# EAGLE design EFS_V2 (EAGLE 9.1.3)
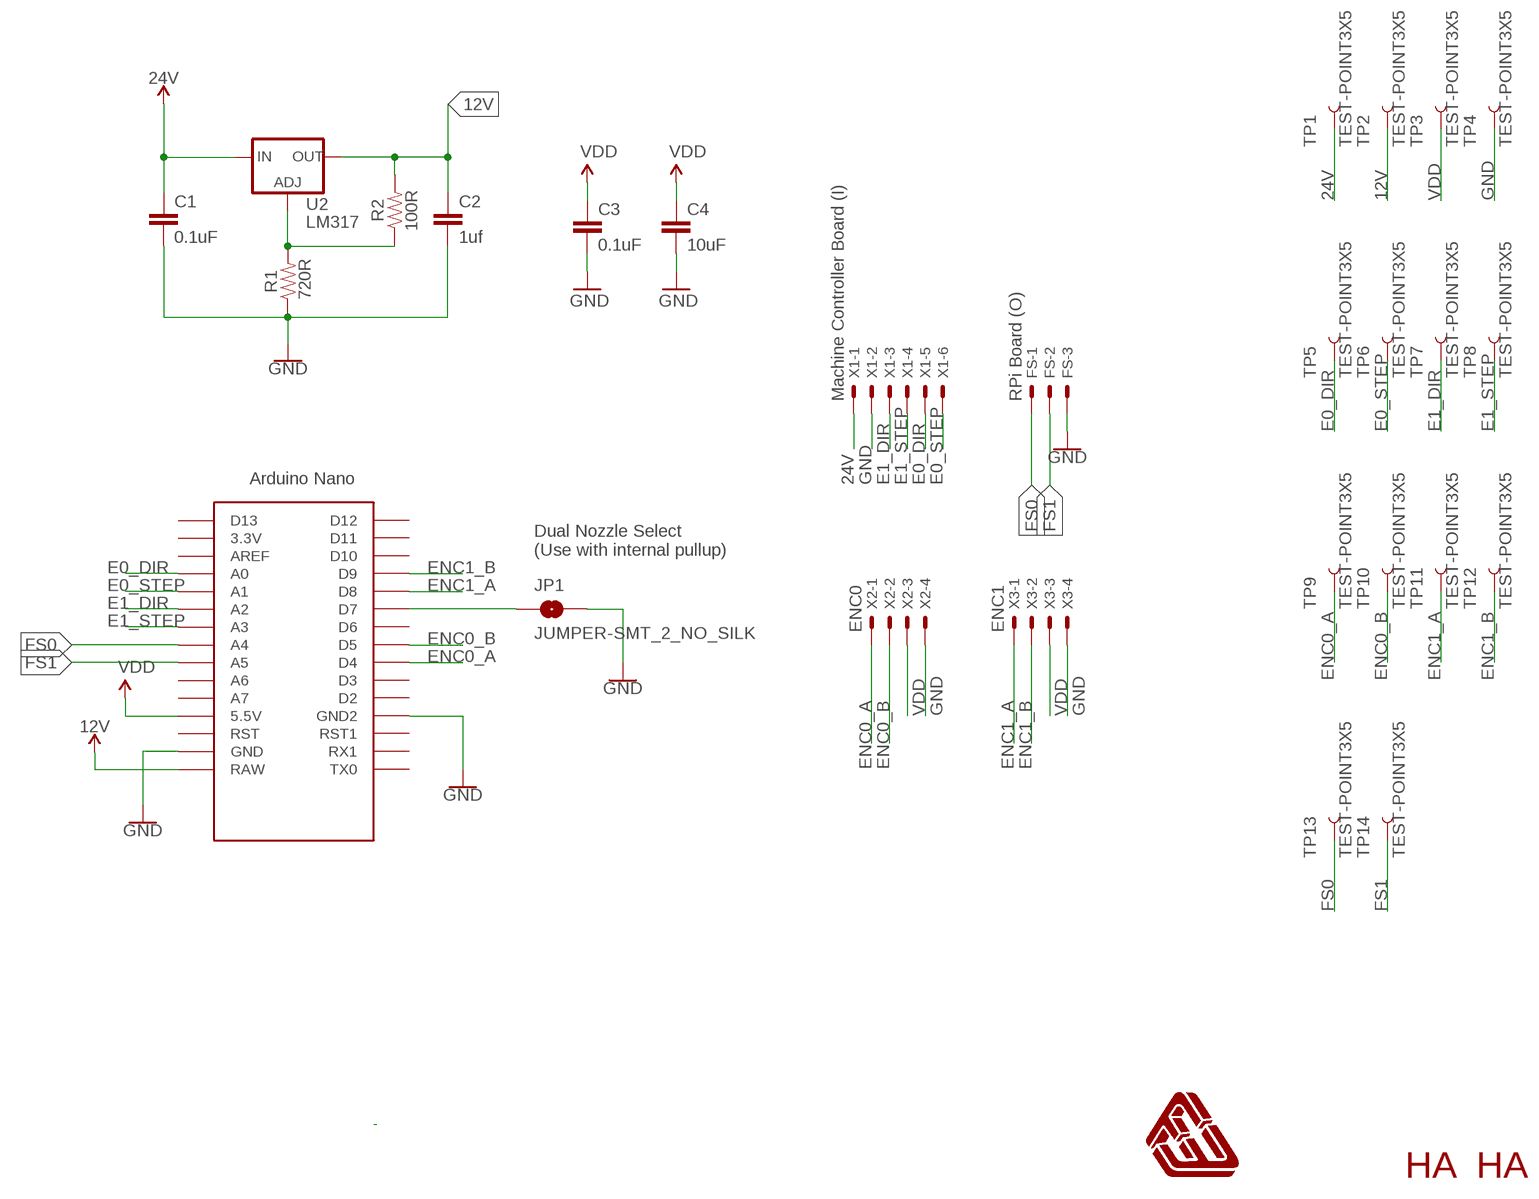
[diagram p0: schematic, sheet 1]

## Parts
C1  0.1uF  9.0PF-0603-50V-10%  [0603]
C2  1uf  9.0PF-0603-50V-10%  [0603]
C3  0.1uF  0.1UF-25V-5%(0603)  [0603-CAP]
C4  10uF  10UF50V20%(1210)  [1210]
FS  RPi Board (O)  JST-XH-03-PIN-LONG-PAD  [JST-XH-03-PACKAGE-LONG-PAD]
JP1  JUMPER-SMT_2_NO_SILK  [SMT-JUMPER_2_NO_SILK]
M_HA_1  HA_MARK  [HA_MARK]
M_HA_2  HA_MARK  [HA_MARK]
R1  720R  RESISTOR0603  [0603]
R2  100R  RESISTOR0603  [0603]
TP1  TEST-POINT3X5  [PAD.03X.05]
TP2  TEST-POINT3X5  [PAD.03X.05]
TP3  TEST-POINT3X5  [PAD.03X.05]
TP4  TEST-POINT3X5  [PAD.03X.05]
TP5  TEST-POINT3X5  [PAD.03X.05]
TP6  TEST-POINT3X5  [PAD.03X.05]
TP7  TEST-POINT3X5  [PAD.03X.05]
TP8  TEST-POINT3X5  [PAD.03X.05]
TP9  TEST-POINT3X5  [PAD.03X.05]
TP10  TEST-POINT3X5  [PAD.03X.05]
TP11  TEST-POINT3X5  [PAD.03X.05]
TP12  TEST-POINT3X5  [PAD.03X.05]
TP13  TEST-POINT3X5  [PAD.03X.05]
TP14  TEST-POINT3X5  [PAD.03X.05]
U2  LM317  V_REG_317SMD  [SOT223]
U$1  NANO  [NANO]
U$2  FWLOGO  [FWLOGO]
X1  Machine Controller Board (I)  JST-XH-06-PIN-LONG-PAD  [JST-XH-06-PACKAGE-LONG-PAD]
X2  ENC0  JST-XH-04-PIN-LONG-PAD  [JST-XH-04-PACKAGE-LONG-PAD]
X3  ENC1  JST-XH-04-PIN-LONG-PAD  [JST-XH-04-PACKAGE-LONG-PAD]

## Nets
12V: C2.1 R2.2 TP2.P$1 U2.2(OUT) U$1.RAW
24V: C1.1 TP1.P$1 U2.3(IN) X1.1
ADJ1: R1.2 R2.1 U2.1(ADJ)
E0_DIR: TP5.P$1 U$1.A0 X1.5
E0_STEP: TP6.P$1 U$1.A1 X1.6
E1_DIR: TP7.P$1 U$1.A2 X1.3
E1_STEP: TP8.P$1 U$1.A3 X1.4
ENC0_A: TP9.P$1 U$1.D4 X2.1
ENC0_B: TP10.P$1 U$1.D5 X2.2
ENC1_A: TP11.P$1 U$1.D8 X3.1
ENC1_B: TP12.P$1 U$1.D9 X3.2
FS0: FS.1 TP13.P$1 U$1.A4
FS1: FS.2 TP14.P$1 U$1.A5
GND: C1.2 C2.2 C3.2 C4.2 FS.3 JP1.2 R1.1 TP4.P$1 U$1.GND U$1.GND1(GND2) X1.2 X2.4 X3.4
N$5: JP1.1 U$1.D7
VDD: C3.1 C4.1 TP3.P$1 U$1.5V(5.5V) X2.3 X3.3
Unconnected: U$1.3.3V U$1.A6 U$1.A7 U$1.AREF U$1.D2 U$1.D3 U$1.D6 U$1.D10 U$1.D11 U$1.D12 U$1.D13 U$1.ICSP1 U$1.ICSP2 U$1.ICSP3 U$1.ICSP4 U$1.ICSP5 U$1.ICSP6 U$1.RST U$1.RST1 U$1.RX1 U$1.TX0

## Notes on the sheet
- Dual Nozzle Select
  (Use with internal pullup)

## Library data of the parts
C1 C2 = SparkFun-Capacitors:9.0PF: 9.0pF ceramic capacitors A capacitor is a passive two-terminal electrical component used to store electrical energy temporarily in an electric field.; PROD_ID: CAP-09341; VALUE: 9.0pF
C3 = SparkFun-Capacitors:0.1UF-25V-5%(0603): CAP-08604; PROD_ID: CAP-08604
C4 = SparkFun-Capacitors:10UF50V20%(1210): CAP-09824; PROD_ID: CAP-09824
FS = Rembrandt:JST-XH-03-PIN: JST XH Connector 2 Pin Wire to board connector. Pitch: 2,54 mm, (0.100") Number of pins: 3 Created by Rembrandt Electronics www.rembrandtelectronics.com
JP1 = SparkFun-Jumpers:JUMPER-SMT_2_NO: Normally open jumper This jumper has two pads in close proximity to each other. Apply solder to close the connection. Round pads are easier to solder for beginners, but are a lot larger. SparkFun Product that uses the round pads: SparkFun EL Sequencer <https://www.sparkfun.com/products/12781>
M_HA_1 M_HA_2 = FracktalWorks:HA_MARK: Maker mark
R1 R2 = SparkFun-Resistors:RESISTOR: Generic Resistor Package
TP1-TP14 = SparkFun-Connectors:TEST-POINT: SparkFun Test Points Bare copper test points for troubleshooting or In-Circuit-Testing. These are used by our Production team for verifying production board runs using pogo-pins on test beds. SparkFun Products: SparkFun LSM9DS1 Breakout <https://www.sparkfun.com/products/13284> SparkFun PSOC <https://www.sparkfun.com/products/13714> SparkFun Load Cell Amplifier <https://www.sparkfun.com/products/13879>
U2 = SparkFun-IC-Power:V_REG_317: Voltage Regulator Standard LM317 adjustable voltage regulator. AOI (Adjust Output Input). Google 'LM317 Calculator' for easy to use app to get the two resistor values needed. 240/720 for 5V output. 240/390 for 3.3V output. Spark Fun Electronics SKU : COM-00527
U$1 = Arduino-clone:NANO: Arduino Nano
U$2 = FracktalWorks:FWLOGO
X1 = Rembrandt Electronics - JST XH Connectors v1-0:JST-XH-06-PIN: JST XH Connector 2 Pin Wire to board connector. Pitch: 2,54 mm, (0.100") Number of pins: 6 Created by Rembrandt Electronics www.rembrandtelectronics.com
X2 X3 = Rembrandt:JST-XH-04-PIN: JST XH Connector 2 Pin Wire to board connector. Pitch: 2,54 mm, (0.100") Number of pins: 4 Created by Rembrandt Electronics www.rembrandtelectronics.com

## Board
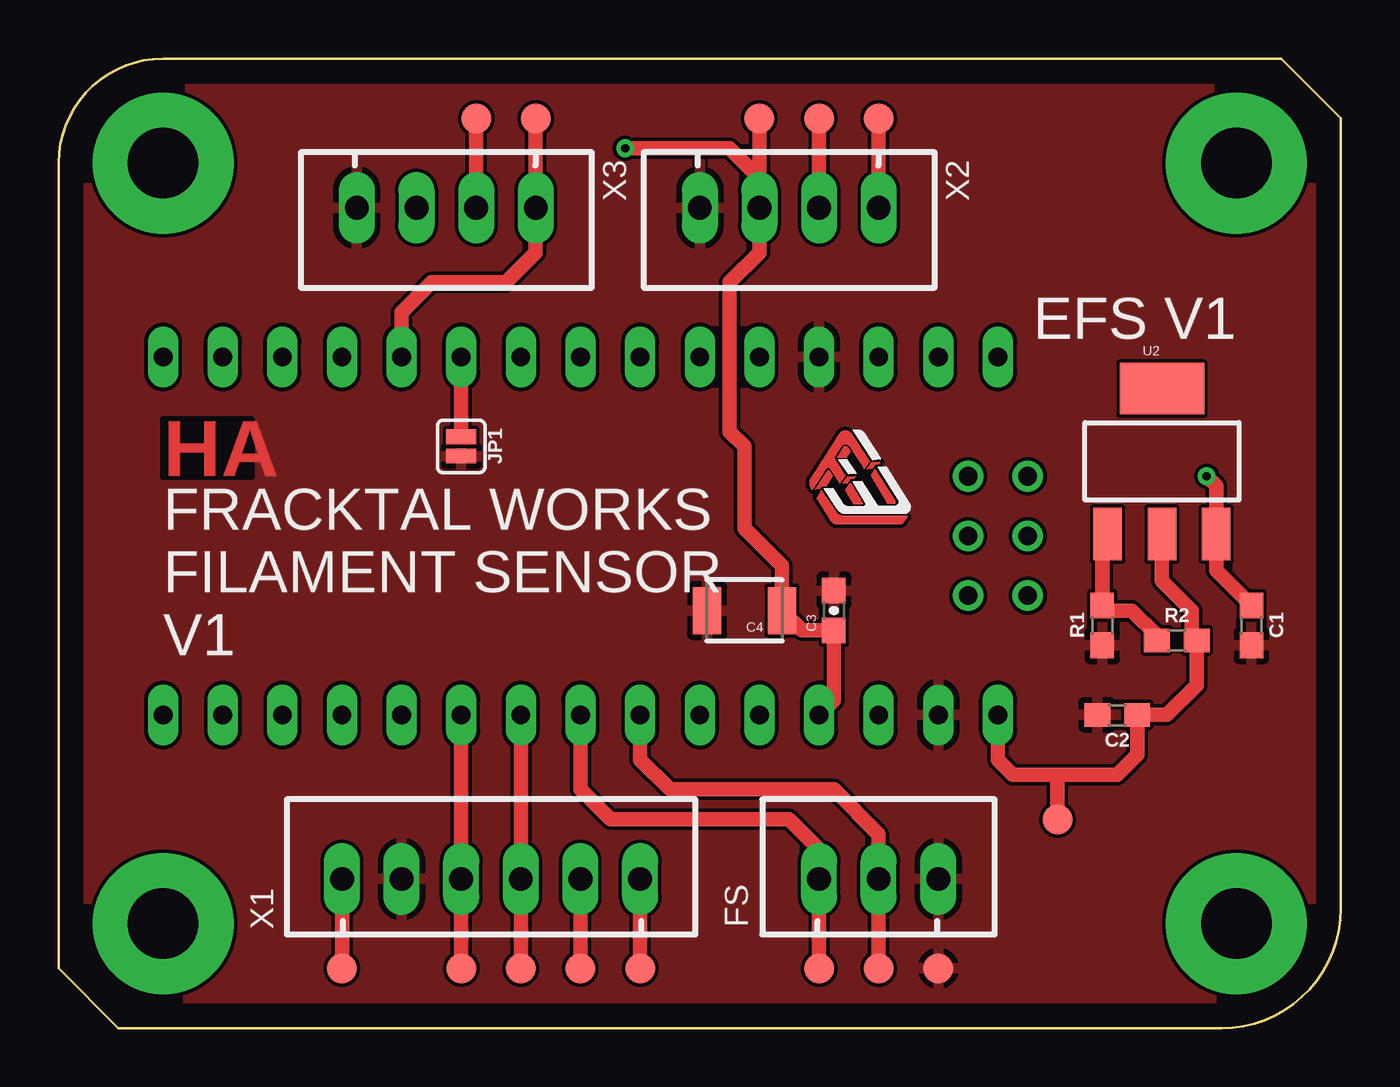
[diagram p1: board, top side]
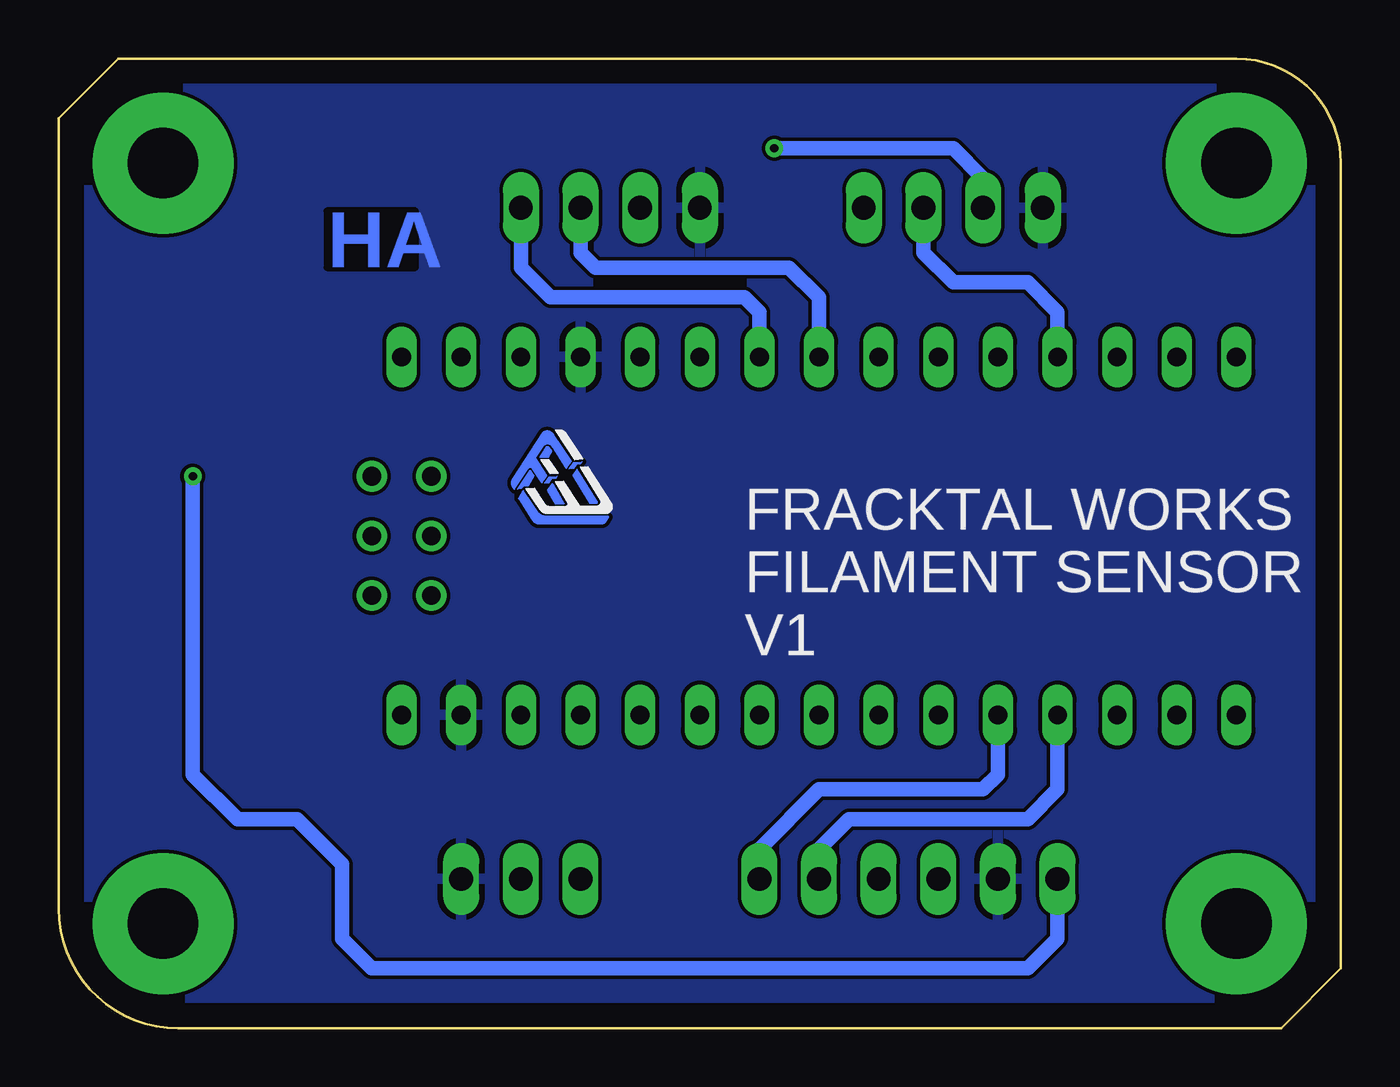
[diagram p2: board, bottom side, seen from below]

Size 54.61 x 41.28 mm. Coordinates in mm from the lower left corner, seen from the top.
Outline: 0,36.83 arc-90 4.45,41.28 52.07,41.28 54.61,38.73 54.61,5.08 arc-90 49.53,0 2.54,0 0,2.54 0,36.83
Copper layers (1*16): Top 0.035mm / dielectric 1.5mm / Bottom 0.035mm
Design rules "default": minimum track width 6mil, minimum drill 0.35mm, track to track 6mil, track to pad 6mil, pad to pad 6mil, via to via 6mil, smd to smd 6mil, copper to edge 40mil, drill to drill 6mil, minimum pad ring 10mil, minimum via ring 8mil, stop-mask expansion 4mil, vias tented up to drill 0mil, thermal gap 10mil

### Footprints (pad centres in the part's own frame; a part is rotated, then mirrored left to right if it is on the bottom)
0603 = smd 1.1 x 1: 1 -0.85,0; 2 0.85,0
0603-CAP = smd 1.1 x 1: 1 -0.85,0; 2 0.85,0
1210 = smd 1.2 x 2: 1 -1.6,0; 2 1.6,0
JST-XH-03-PACKAGE-LONG-PAD = drill 1.016 long: 1 -2.54,0; 2 0,0; 3 2.54,0
SMT-JUMPER_2_NO_SILK = smd 0.635 x 1.27: 1 -0.406,0; 2 0.406,0
PAD.03X.05 = smd 1.27 x 1.27: P$1 0,0
SOT223 = smd 1.219 x 2.235: 1 -2.311,-3.099; 2 0,-3.099; 3 2.311,-3.099 | smd 3.6 x 2.2: 4 0,3.099
NANO = drill 0.8 long: 3.3V -10.16,24.13; 5V -10.16,-1.27; A0 -10.16,19.05; A1 -10.16,16.51; A2 -10.16,13.97; A3 -10.16,11.43; A4 -10.16,8.89; A5 -10.16,6.35; A6 -10.16,3.81; A7 -10.16,1.27; AREF -10.16,21.59; D2 5.08,1.27; D3 5.08,3.81; D4 5.08,6.35; D5 5.08,8.89; D6 5.08,11.43; D7 5.08,13.97; D8 5.08,16.51; D9 5.08,19.05; D10 5.08,21.59; D11 5.08,24.13; D12 5.08,26.67; D13 -10.16,26.67; GND -10.16,-6.35; GND1 5.08,-1.27; RAW -10.16,-8.89; RST -10.16,-3.81; RST1 5.08,-3.81; RX1 5.08,-6.35; TX0 5.08,-8.89 | drill 0.8: ICSP1 -5.08,-10.16; ICSP2 -5.08,-7.62; ICSP3 -2.54,-10.16; ICSP4 -2.54,-7.62; ICSP5 0,-10.16; ICSP6 0,-7.62
JST-XH-06-PACKAGE-LONG-PAD = drill 1.016 long: 1 -6.35,0; 2 -3.81,0; 3 -1.27,0; 4 1.27,0; 5 3.81,0; 6 6.35,0
JST-XH-04-PACKAGE-LONG-PAD = drill 1.016 long: 1 -3.81,0; 2 -1.27,0; 3 1.27,0; 4 3.81,0

### Placement (x,y rotation side)
C1  50.8,17.14 270 top
C2  45.09,13.34 180 top
C3  33.02,17.78 90 top
C4  29.21,17.78 180 top
FS  34.92,6.35 0 top
JP1  17.14,24.77 270 top
M_HA_1  4.45,23.5 0 top
M_HA_2  43.18,32.39 0 bottom
R1  44.45,17.14 90 top
R2  47.62,16.51 0 top
TP1  12.06,2.54 90 top
TP2  42.55,8.89 90 top
TP3  29.84,38.73 0 top
TP4  37.47,2.54 90 top
TP5  22.23,2.54 90 top
TP6  24.77,2.54 90 top
TP7  17.14,2.54 90 top
TP8  19.68,2.54 90 top
TP9  34.92,38.73 90 top
TP10  32.38,38.73 90 top
TP11  20.32,38.73 90 top
TP12  17.78,38.73 90 top
TP13  32.38,2.54 90 top
TP14  34.92,2.54 90 top
U2  46.99,24.13 0 top
U$1  31.11,23.5 90 top
U$2  30.48,20.32 0 top
U$4  FWLOGO  [FWLOGO]  36.83,20.32 0 bottom
X1  18.41,6.35 0 top
X2  31.11,34.93 180 top
X3  16.51,34.93 180 top

### Tracks (layer width: path | path; a pad name or v marks a point on that pad's centre or on a via)
12V
  Top 0.61: U2.2 46.99,19.05 48.26,17.78 48.26,16.72 R2.2 48.48,14.61 47.2,13.34 C2.1 45.94,11.64 45.09,10.8 42.55,10.8 | U$1.RAW 40.01,11.43 40.64,10.8 42.55,10.8 | TP2.P$1 42.55,10.8
24V  (via drill 0.35)
  Top 0.61: C1.1 49.3,19.49 U2.3 49.3,23.09 v48.9,23.5 | X1.1 TP1.P$1
  Bottom 0.61: v48.9,23.5 48.9,10.8 46.99,8.89 44.45,8.89 42.55,6.99 42.55,3.81 41.27,2.54 13.34,2.54 12.06,3.81 X1.1
ADJ1
  Top 0.61: U2.1 44.87,20.84 44.45,20.42 R1.2 44.66,17.78 45.72,17.78 46.77,16.72 R2.1
E0_DIR
  Top 0.61: TP5.P$1 X1.5
  Bottom 0.61: X1.5 22.23,7.62 20.95,8.89 13.34,8.89 12.06,10.16 U$1.A0
E0_STEP
  Top 0.61: TP6.P$1 X1.6
  Bottom 0.61: X1.6 24.77,7.62 22.23,10.16 15.24,10.16 14.61,10.8 U$1.A1
E1_DIR
  Top 0.61: TP7.P$1 X1.3 U$1.A2
E1_STEP
  Top 0.61: TP8.P$1 X1.4 U$1.A3
ENC0_A
  Top 0.61: X2.1 TP9.P$1
  Bottom 0.61: X2.1 34.92,32.39 33.66,31.11 25.4,31.11 24.77,30.48 U$1.D4
ENC0_B
  Top 0.61: X2.2 TP10.P$1
  Bottom 0.61: U$1.D5 22.23,31.11 23.5,32.39 31.75,32.39 32.38,33.02 X2.2
ENC1_A
  Top 0.61: U$1.D8 14.61,30.48 15.88,31.75 19.05,31.75 20.32,33.02 X3.1 TP11.P$1
ENC1_B
  Top 0.61: X3.2 TP12.P$1
  Bottom 0.61: U$1.D9 12.06,30.48 13.34,31.75 16.51,31.75 17.78,33.02 X3.2
FS0
  Top 0.61: TP13.P$1 FS.1 32.38,7.62 31.11,8.89 23.5,8.89 22.23,10.16 U$1.A4
FS1
  Top 0.61: TP14.P$1 FS.2 34.92,8.25 33.02,10.16 26.04,10.16 24.77,11.43 U$1.A5
GND
  pour Top: -1.27,-4.45 -1.27,42.55 55.88,42.55 55.88,-4.45
  pour Bottom: -2.54,43.82 -2.54,-5.71 57.15,-5.71 57.15,43.82
N$5
  Top 0.61: JP1.1 U$1.D7
N$7  (via drill 3 pad 6)
  other vias: 4.45,36.83
N$8  (via drill 3 pad 6)
  other vias: 50.16,36.83
N$9  (via drill 3 pad 6)
  other vias: 4.45,4.45
N$10  (via drill 3 pad 6)
  other vias: 50.16,4.45
VDD  (via drill 0.35)
  Top 0.61: U$1.5V 33.02,13.97 C3.1 31.66,16.93 C4.1 30.81,19.68 29.21,21.29 29.21,24.77 28.57,25.4 28.57,31.75 29.84,33.02 X2.3 | X2.3 29.84,36.2 28.57,37.47 v24.13,37.47 | X2.3 TP3.P$1
  Bottom 0.61: v24.13,37.47 16.51,37.47 15.24,36.2 X3.3

### Text on the board
tPlace: EFS V1 | FRACKTAL WORKS / FILAMENT SENSOR / V1
bPlace: FRACKTAL WORKS / FILAMENT SENSOR / V1